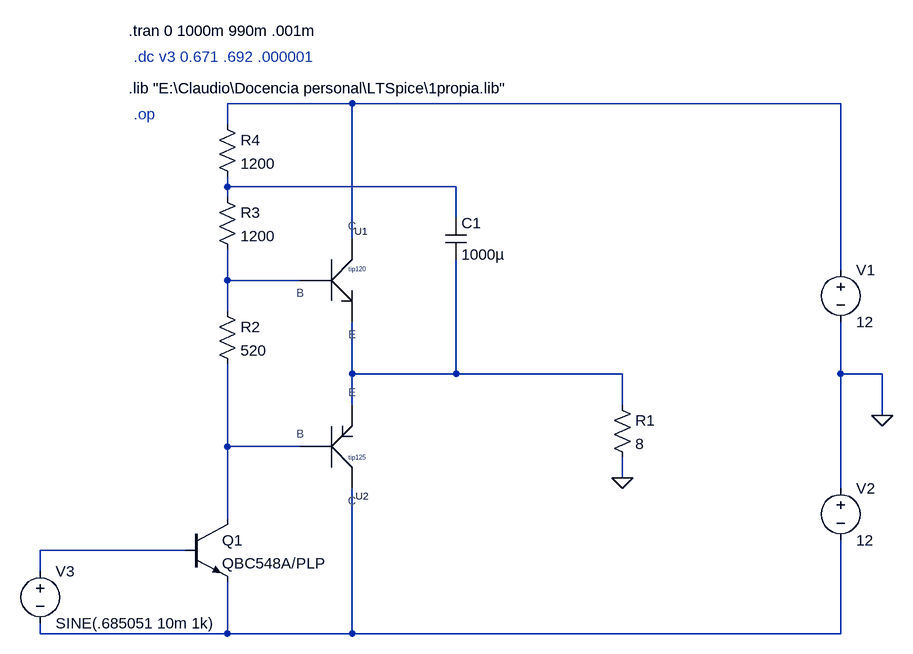
[diagram p0: schematic clase b darlington2.asc]
clase b darlington2.asc, the LTspice schematic file:
Version 4
SHEET 1 1572 760
WIRE 736 -64 544 -64
WIRE 1488 -64 736 -64
WIRE 544 -32 544 -64
WIRE 544 64 544 48
WIRE 896 64 544 64
WIRE 544 80 544 64
WIRE 896 112 896 64
WIRE 736 144 736 -64
WIRE 1488 192 1488 -64
WIRE 544 208 544 160
WIRE 656 208 544 208
WIRE 544 256 544 208
WIRE 736 352 736 272
WIRE 896 352 896 176
WIRE 896 352 736 352
WIRE 1152 352 896 352
WIRE 1488 352 1488 272
WIRE 1552 352 1488 352
WIRE 736 400 736 352
WIRE 1152 400 1152 352
WIRE 1552 416 1552 352
WIRE 544 464 544 336
WIRE 656 464 544 464
WIRE 1152 512 1152 480
WIRE 1488 528 1488 352
WIRE 544 576 544 464
WIRE 480 624 256 624
WIRE 256 656 256 624
WIRE 256 752 256 736
WIRE 544 752 544 672
WIRE 544 752 256 752
WIRE 736 752 736 528
WIRE 736 752 544 752
WIRE 1488 752 1488 608
WIRE 1488 752 736 752
FLAG 1152 512 0
FLAG 1552 416 0
DATAFLAG 1024 352 ""
DATAFLAG 608 208 ""
DATAFLAG 592 464 ""
SYMBOL Darlington\ npn 704 208 R0
SYMATTR Value tip120
SYMATTR InstName U1
SYMBOL Darlington\ pnp 704 464 M180
SYMATTR Value tip125
SYMATTR InstName U2
SYMBOL res 1136 384 R0
SYMATTR InstName R1
SYMATTR Value 8
SYMBOL npn 480 576 R0
SYMATTR InstName Q1
SYMATTR Value QBC548A/PLP
SYMBOL voltage 1488 176 R0
WINDOW 123 0 0 Left 0
WINDOW 39 0 0 Left 0
SYMATTR InstName V1
SYMATTR Value 12
SYMBOL voltage 1488 512 R0
WINDOW 123 0 0 Left 0
WINDOW 39 0 0 Left 0
SYMATTR InstName V2
SYMATTR Value 12
SYMBOL res 528 240 R0
SYMATTR InstName R2
SYMATTR Value 520
SYMBOL voltage 256 640 R0
WINDOW 123 0 0 Left 0
WINDOW 39 0 0 Left 0
SYMATTR InstName V3
SYMATTR Value SINE(.685051 10m 1k)
SYMBOL res 528 64 R0
SYMATTR InstName R3
SYMATTR Value 1200
SYMBOL res 528 -48 R0
SYMATTR InstName R4
SYMATTR Value 1200
SYMBOL cap 880 112 R0
SYMATTR InstName C1
SYMATTR Value 1000µ
TEXT 392 -88 Left 2 !.lib "E:\\Claudio\\Docencia personal\\LTSpice\\1propia.lib"
TEXT 400 -48 Left 2 ;.op
TEXT 400 -136 Left 2 ;.dc v3 0.671 .692 .000001
TEXT 392 -176 Left 2 !.tran 0 1000m 990m .001m

The netlist it stands for:
* clase b darlington2.asc
XU1 N001 N003 N004 tip120  ; pins C B E
XU2 N007 N005 N004 tip125  ; pins C B E
R1 N004 0 8
Q1 N005 N006 N007 0 QBC548A/PLP
V1 N001 0 12
V2 0 N007 12
R2 N003 N005 520
V3 N006 N007 SINE(.685051 10m 1k)
R3 N002 N003 1200
R4 N001 N002 1200
C1 N002 N004 1000µ
.model NPN NPN
.model PNP PNP
.lib standard.bjt
.lib "E:\Claudio\Docencia personal\LTSpice\1propia.lib"
* .op
* .dc v3 0.671 .692 .000001
.tran 0 1000m 990m .001m
.backanno
.end